# EAGLE schematic 1Лампа (EAGLE 9.4.2)

## Sheet 1 of 4: Лампа
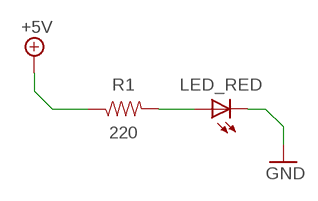
[diagram p0: schematic, sheet 1]

### Parts
LED_RED  LED5MM  [LED5MM]
R1  220  100OHM-HORIZ-1/4W-1%  [AXIAL-0.3]

### Nets
+5V: R1.P$1 ; also sheet 2,3
GND: LED_RED.K(C) ; also sheet 2,3,4
N$7: LED_RED.A R1.P$2

## Sheet 2 of 4
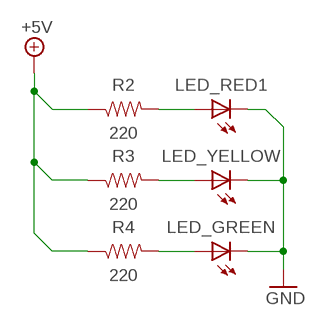
[diagram p1: schematic, sheet 2]

### Parts
LED_GREEN  LED5MM  [LED5MM]
LED_RED1  LED5MM  [LED5MM]
LED_YELLOW  LED5MM  [LED5MM]
R2  220  100OHM-HORIZ-1/4W-1%  [AXIAL-0.3]
R3  220  100OHM-HORIZ-1/4W-1%  [AXIAL-0.3]
R4  220  100OHM-HORIZ-1/4W-1%  [AXIAL-0.3]

### Nets
+5V: R2.P$1 R3.P$1 R4.P$1 ; also sheet 1,3
GND: LED_GREEN.K(C) LED_RED1.K(C) LED_YELLOW.K(C) ; also sheet 1,3,4
N$1: LED_RED1.A R2.P$2
N$2: LED_YELLOW.A R3.P$2
N$3: LED_GREEN.A R4.P$2

## Sheet 3 of 4
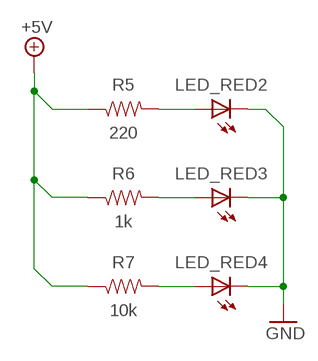
[diagram p2: schematic, sheet 3]

### Parts
LED_RED2  LED5MM  [LED5MM]
LED_RED3  LED5MM  [LED5MM]
LED_RED4  LED5MM  [LED5MM]
R5  220  100OHM-HORIZ-1/4W-1%  [AXIAL-0.3]
R6  1k  100OHM-HORIZ-1/4W-1%  [AXIAL-0.3]
R7  10k  100OHM-HORIZ-1/4W-1%  [AXIAL-0.3]

### Nets
+5V: R5.P$1 R6.P$1 R7.P$1 ; also sheet 1,2
GND: LED_RED2.K(C) LED_RED3.K(C) LED_RED4.K(C) ; also sheet 1,2,4
N$4: LED_RED2.A R5.P$2
N$5: LED_RED3.A R6.P$2
N$6: LED_RED4.A R7.P$2

## Sheet 4 of 4
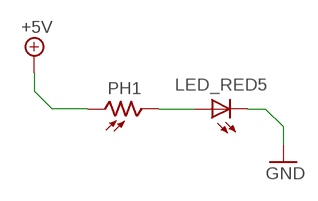
[diagram p3: schematic, sheet 4]

### Parts
LED_RED5  LED5MM  [LED5MM]
PH1  D1160_12  [D11XX]

### Nets
GND: LED_RED5.K(C) ; also sheet 1,2,3
N$8: PH1.1 ; supply symbol labelled +5V
N$9: LED_RED5.A PH1.2

## Library data of the parts
LED_GREEN LED_RED LED_RED1-LED_RED5 LED_YELLOW = adafruit:LED: LED OSRAM: - CHIPLED LG R971, LG N971, LY N971, LG Q971, LY Q971, LO R971, LY R971 LH N974, LH R974 LS Q976, LO Q976, LY Q976 LO Q996 - Hyper CHIPLED LW Q18S LB Q993, LB Q99A, LB R99A - SideLED LS A670, LO A670, LY A670, LG A670, LP A670 LB A673, LV A673, LT A673, LW A673 LH A674 LY A675 LS A676, LA A676, LO A676, LY A676, LW A676 LS A679, LY A679, LG A679 - Hyper Micro SIDELED® LS Y876, LA Y876, LO Y876, LY Y876 LT Y87S - SmartLED LW L88C, LW L88S LB L89C, LB L89S, LG L890 LS L89K, LO L89K, LY L89K LS L896, LA L896, LO L896, LY L896 - TOPLED LS T670, LO T670, LY T670, LG T670, LP T670 LSG T670, LSP T670, LSY T670, LOP T670, LYG T670 LG T671, LOG T671, LSG T671 LB T673, LV T673, LT T673, LW T673 LH T674 LS T676, LA T676, LO T676, LY T676, LB T676, LH T676, LSB T676, LW T676 LB T67C, LV T67C, LT T67C, LS T67K, LO T67K, LY T67K, LW E67C LS E67B, LA E67B, LO E67B, LY E67B, LB E67C, LV E67C, LT E67C LW T67C LS T679, LY T679, LG T679 LS T770, LO T770, LY T770, LG T770, LP T770 LB T773, LV T773, LT T773, LW T773 LH T774 LS E675, LA E675, LY E675, LS T675 LS T776, LA T776, LO T776, LY T776, LB T776 LHGB T686 LT T68C, LB T68C - Hyper Mini TOPLED® LB M676 - Mini TOPLED Santana® LG M470 LS M47K, LO M47K, LY M47K Source: http://www.osram.convergy.de/
PH1 = photo-elements:D11: Photo Sensor Oil Burner Control Applications Source: http://optoelectronics.perkinelmer.com/content/Datasheets/DTS_PhotocellsD1160.pdf
R1-R7 = SparkFun-Resistors:100OHM: 100Ω resistor A resistor is a passive two-terminal electrical component that implements electrical resistance as a circuit element. Resistors act to reduce current flow, and, at the same time, act to lower voltage levels within circuits. - Wikipedia; PROD_ID: RES-12181; VALUE: 100